# Altium project PCB_MCS_MEA.PrjPcb
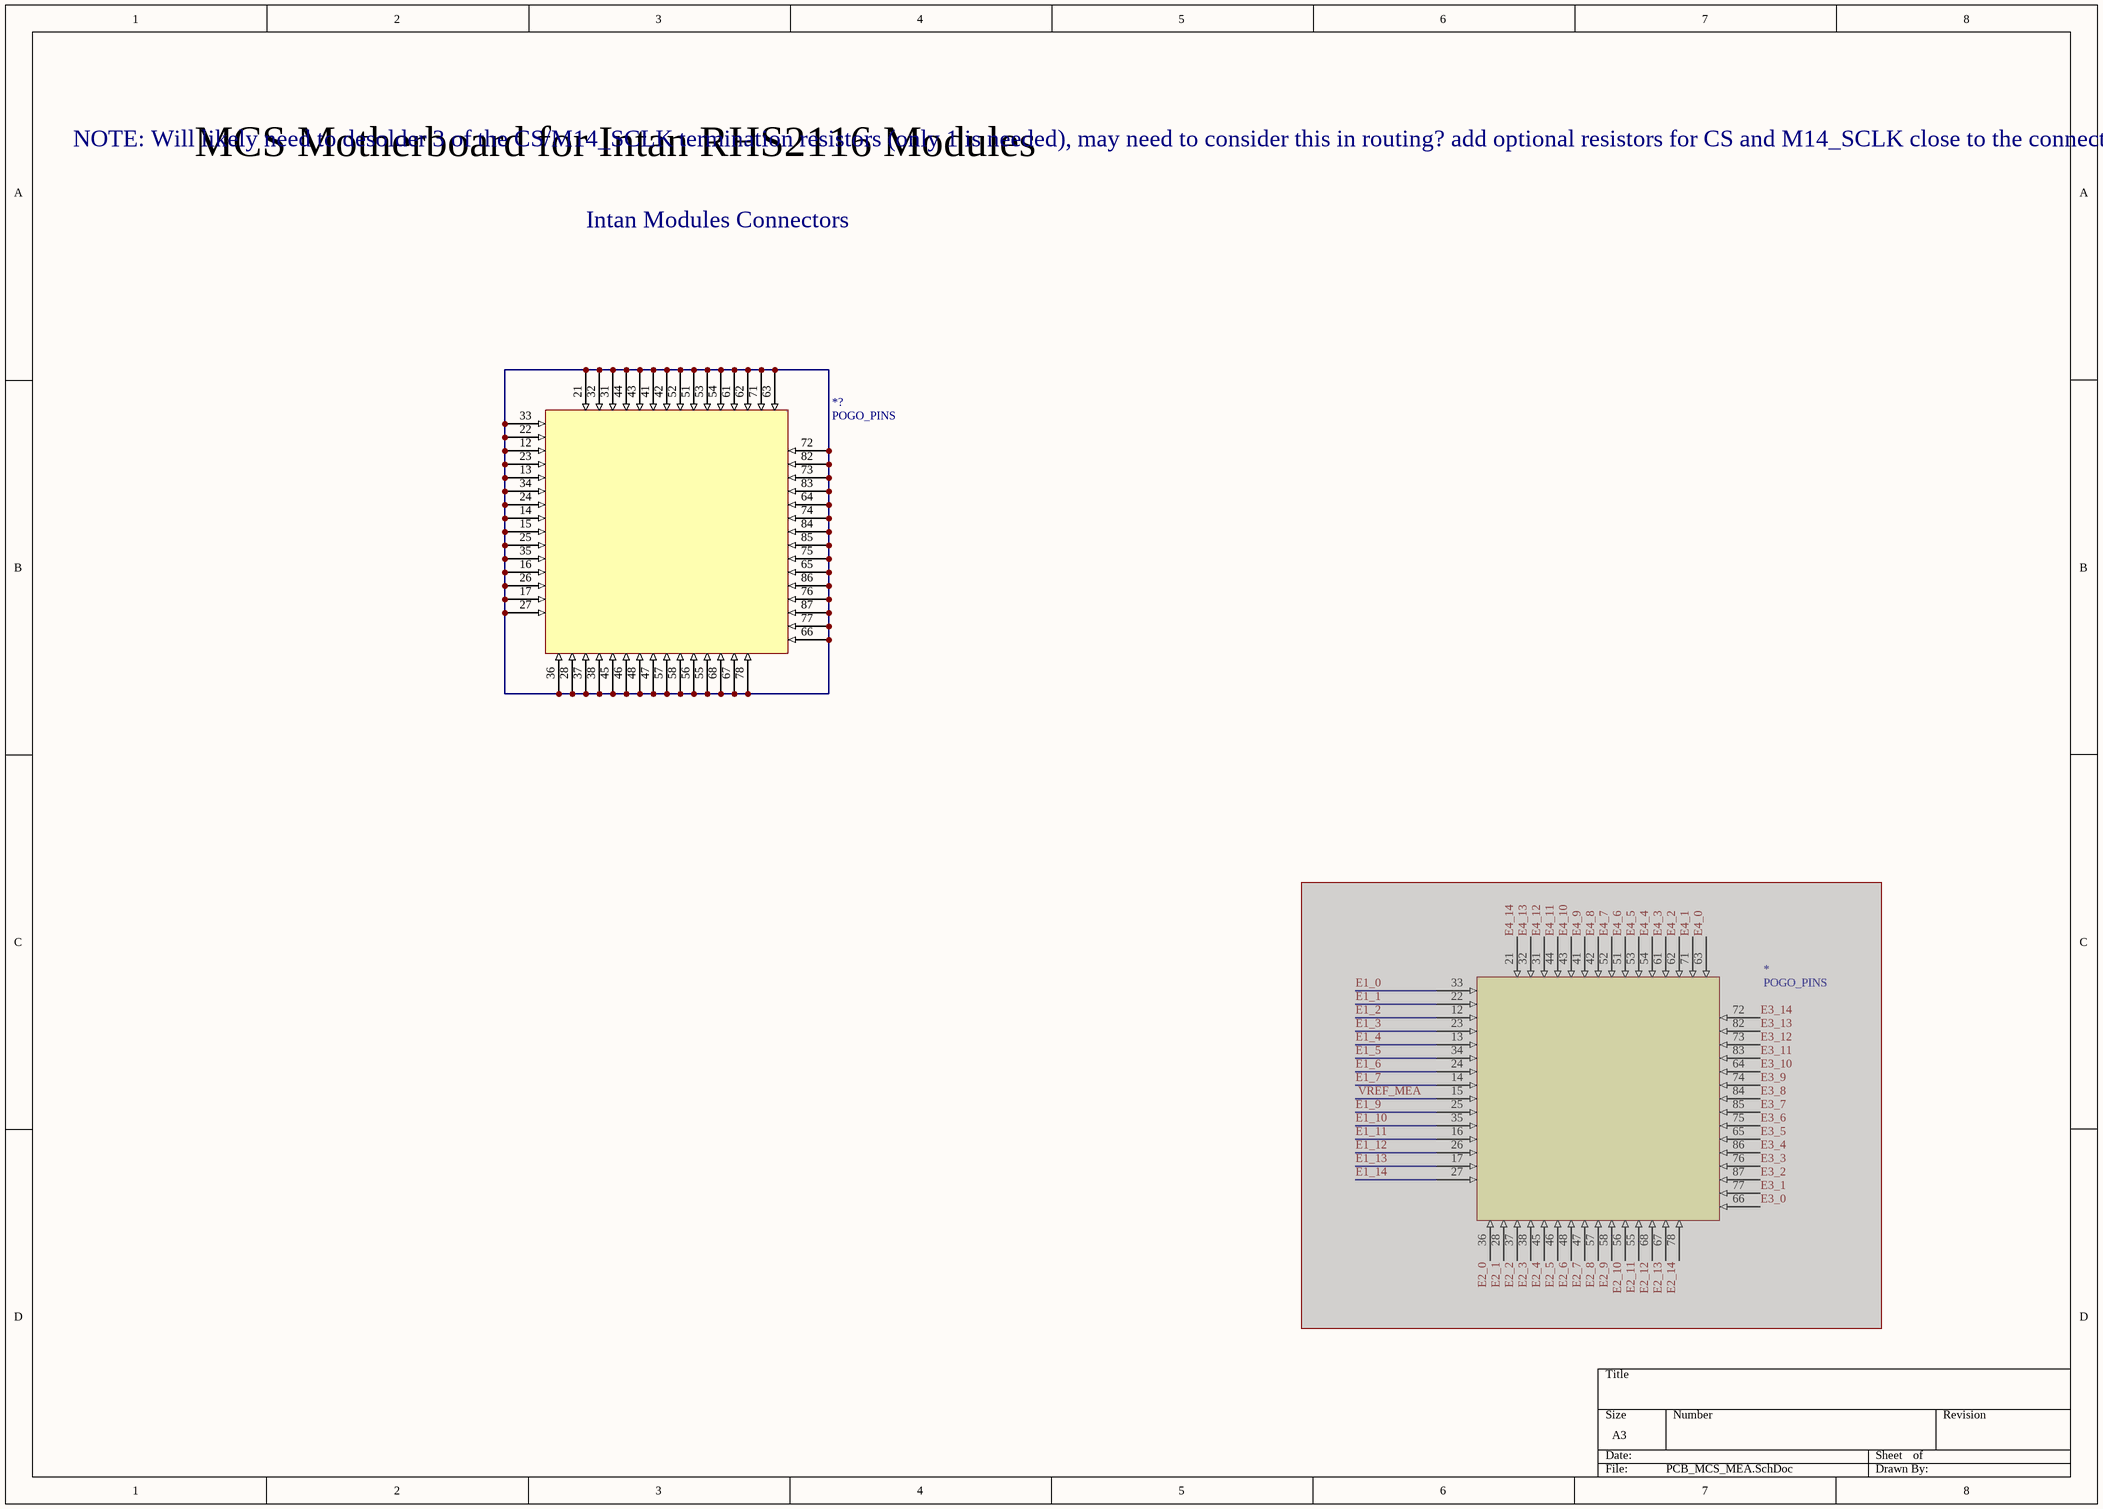
[diagram p0: PCB_MCS_MEA.SchDoc]
1 sheet, 2 parts. Net scope: hierarchical (ports join the sheet entries above them; power ports are global).
Board file: PCB_MCS_MEA.PcbDoc

## Sheet PCB_MCS_MEA.SchDoc
size A3

### Parts
*  POGO_PINS  [POGO_PINS]  (masked out: inside a compile mask, not in the netlist)
*?  POGO_PINS  [MCS_MEA_VE_TEST_1P25]

### Nets
Net*?_12: *?.12 *?.13 *?.14 *?.15 *?.16 *?.17 *?.21 *?.22 *?.23 *?.24 *?.25 *?.26 *?.27 *?.28 *?.31 *?.32 *?.33 *?.34 *?.35 *?.36 *?.37 *?.38 *?.41 *?.42 *?.43 *?.44 *?.45 *?.46 *?.47 *?.48 *?.51 *?.52 *?.53 *?.54 *?.55 *?.56 *?.57 *?.58 *?.61 *?.62 *?.63 *?.64 *?.65 *?.66 *?.67 *?.68 *?.71 *?.72 *?.73 *?.74 *?.75 *?.76 *?.77 *?.78 *?.82 *?.83 *?.84 *?.85 *?.86 *?.87

### Notes on the sheet
- NOTE: Will likely need to desolder 3 of the CS/M14_SCLK termination resistors (only 1 is needed), may need to consider this in routing? add optional resistors for CS and M14_SCLK close to the connector?
- MCS Motherboard for Intan RHS2116 Modules
- Intan Modules Connectors